# EAGLE design SmodOC1 (EAGLE 6.3)
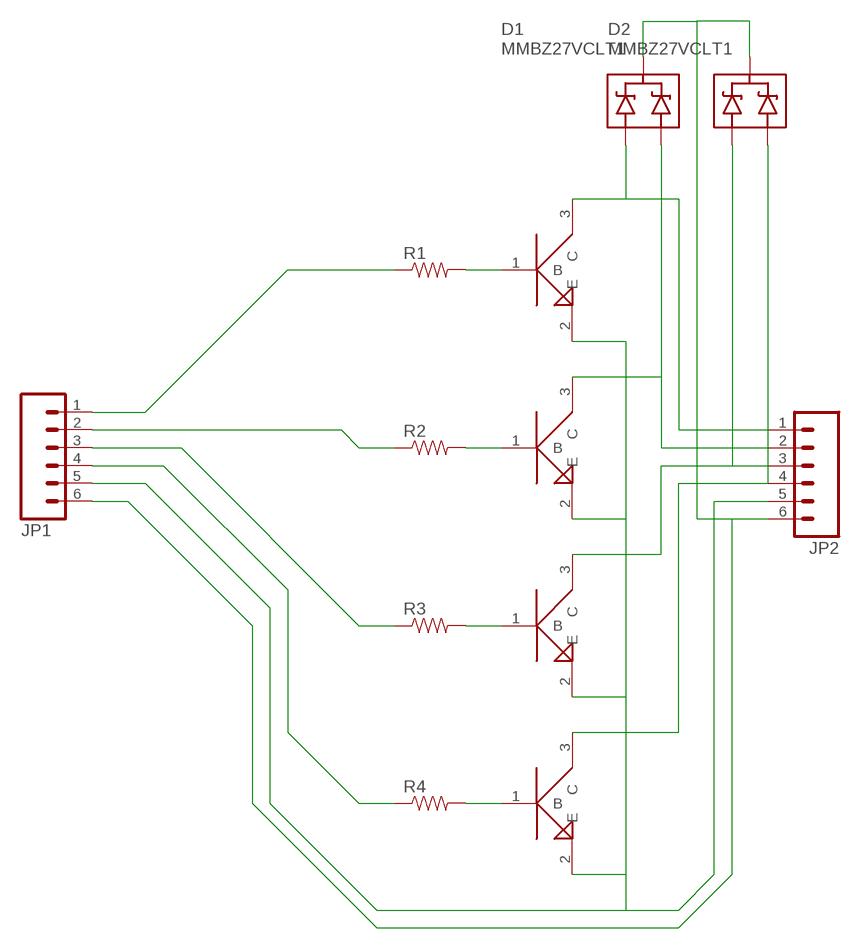
[diagram p0: schematic, sheet 1]

## Parts
D1  MMBZ27VCLT1  [SOT23-3]
D2  MMBZ27VCLT1  [SOT23-3]
JP1  M06POGOPIN_HOLES_ONLY  [1X06_HOLES_ONLY]
JP2  M06POGOPIN_HOLES_ONLY  [1X06_HOLES_ONLY]
Q1  MMBT3904  [SOT-23]
Q2  MMBT3904  [SOT-23]
Q3  MMBT3904  [SOT-23]
Q4  MMBT3904  [SOT-23]
R1  RESISTOR0603-RES  [0603-RES]
R2  RESISTOR0603-RES  [0603-RES]
R3  RESISTOR0603-RES  [0603-RES]
R4  RESISTOR0603-RES  [0603-RES]

## Nets
GND: JP1.5 JP2.5 Q1.2(E) Q2.2(E) Q3.2(E) Q4.2(E)
N$2: Q1.1(B) R1.2
N$4: Q2.1(B) R2.2
N$6: Q3.1(B) R3.2
N$8: Q4.1(B) R4.2
Q1: JP1.1 R1.1
Q2: JP1.2 R2.1
Q3: JP1.3 R3.1
Q4: JP1.4 R4.1
QO1: D1.1(A1) JP2.1 Q1.3(C)
QO2: D1.2(A2) JP2.2 Q2.3(C)
QO3: D2.1(A1) JP2.3 Q3.3(C)
QO4: D2.2(A2) JP2.4 Q4.3(C)
VCC: D1.3(C) D2.3(C) JP1.6 JP2.6

## Library data of the parts
D1 D2 = SparkFun-DiscreteSemi:MMBZ27VCLT1: 40W Zener-diode transient voltage suppressor (ESD protection)
JP1 JP2 = SparkFun-Connectors:M06: Header 6 Standard 6-pin 0.1" header. Use with straight break away headers (SKU : PRT-00116), right angle break away headers (PRT-00553), swiss pins (PRT-00743), machine pins (PRT-00117), and female headers (PRT-00115). Molex polarized connector foot print use with SKU : PRT-08094 with associated crimp pins and housings. NOTES ON THE VARIANTS LOCK and LOCK_LONGPADS... This footprint was designed to help hold the alignment of a through-hole component (i.e. 6-pin header) while soldering it into place. You may notice that each hole has been shifted either up or down by 0.005 of an inch from it's more standard position (which is a perfectly straight line). This slight alteration caused the pins (the squares in the middle) to touch the edges of the holes. Because they are alternating, it causes a "brace" to hold the component in place. 0.005 has proven to be the perfect amount of "off-center" position when using our standard breakaway headers. Although looks a little odd when you look at the bare footprint, once you have a header in there, the alteration is very hard to notice. Also, if you push a header all the way into place, it is covered up entirely on the bottom side. This idea of altering the position of holes to aid alignment will be further integrated into the Sparkfun Library for other footprints. It can help hold any component with 3 or more connection pins.
Q1-Q4 = Strutz Electronic Industries:MMBT3904
R1-R4 = SparkFun-Passives:RESISTOR: Resistor Basic schematic elements and footprints for 0603, 1206, and PTH resistors.

## Board
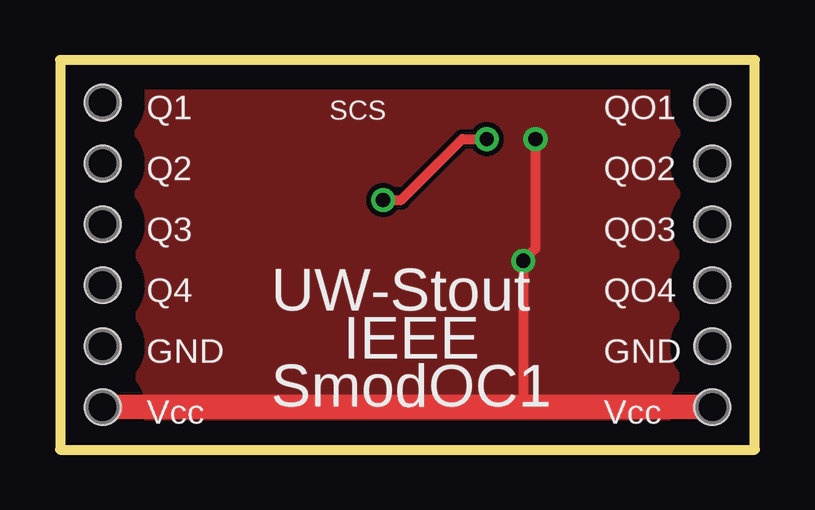
[diagram p1: board, top side]
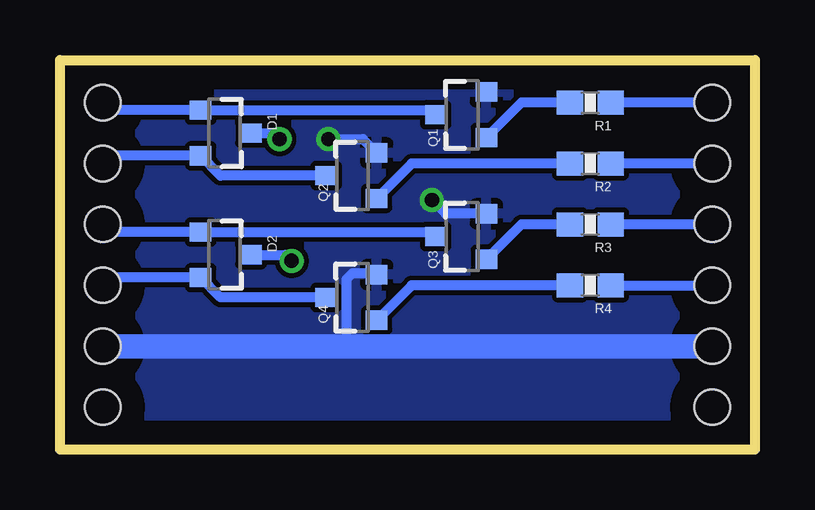
[diagram p2: board, bottom side, seen from below]

Size 28.96 x 16.26 mm. Coordinates in mm from the lower left corner, seen from the top.
Outline: 0,0 28.96,0 28.96,16.26 0,16.26 0,0
Copper layers (1*16): Top 0.035mm / dielectric 1.5mm / Bottom 0.035mm
Design rules "default": minimum track width 10mil, minimum drill 24mil, track to track 8mil, track to pad 8mil, pad to pad 8mil, via to via 8mil, smd to smd 8mil, copper to edge 40mil, drill to drill 8mil, minimum pad ring 10mil, minimum via ring 8mil, stop-mask expansion 4mil, vias tented up to drill 0mil, thermal gap 10mil

### Footprints (pad centres in the part's own frame; a part is rotated, then mirrored left to right if it is on the bottom)
SOT23-3 = smd 0.8 x 0.9: 1 -0.95,-1; 2 0.95,-1; 3 0,1.1
1X06_HOLES_ONLY = drill 0.889 pad 0.813: 1 0,0; 2 2.54,0; 3 5.08,0; 4 7.62,0; 5 10.16,0; 6 12.7,0 | hole 1.473: 0,0; 2.54,0; 5.08,0; 7.62,0; 10.16,0; 12.7,0
SOT-23 = smd 0.8 x 0.9: 1 -0.95,-1; 2 0.95,-1; 3 0,1.1
0603-RES = smd 1.1 x 1: 1 -0.85,0; 2 0.85,0

### Placement (x,y rotation side)
D1  22.1,13.21 270 bottom
D2  22.1,8.13 270 bottom
JP1  1.78,14.48 270 top
JP2  27.18,14.48 270 top
Q1  12.19,13.97 90 bottom
Q2  16.76,11.43 90 bottom
Q3  12.19,8.89 90 bottom
Q4  16.76,6.35 90 bottom
R1  6.86,14.48 180 bottom
R2  6.86,11.94 180 bottom
R3  6.86,9.4 180 bottom
R4  6.86,6.86 180 bottom

### Tracks (layer width: path | path; a pad name or v marks a point on that pad's centre or on a via)
GND  (via drill 0.6)
  Top 0.406: v13.46,10.41 14.22,10.41 16.76,12.95 v17.78,12.95
  Bottom 0.406: Q3.2 12.89,9.84 v13.46,10.41 | v17.78,12.95 16.34,12.95 Q2.2 | 17.02,4.32 17.02,7.11 16.76,7.37 15.83,7.37 Q4.2
  Bottom 1.016: JP2.5 17.02,4.32 JP1.5
  pour Bottom: 0,16.26 28.96,16.26 28.96,0 0,0
N$2
  Bottom 0.406: R1.2 9.73,14.48 Q1.1
N$4
  Bottom 0.406: R2.2 14.31,11.94 Q2.1
N$6
  Bottom 0.406: R3.2 9.73,9.4 Q3.1
N$8
  Bottom 0.406: R4.2 14.31,6.86 Q4.1
Q1
  Bottom 0.406: JP1.1 R1.1
Q2
  Bottom 0.406: JP1.2 R2.1
Q3
  Bottom 0.406: JP1.3 R3.1
Q4
  Bottom 0.406: R4.1 JP1.4
QO1
  Bottom 0.406: Q1.3 13.48,14.16 D1.1 26.86,14.16 JP2.1
QO2
  Bottom 0.406: Q2.3 22.27,11.43 D1.2 26.86,12.26 JP2.2
QO3
  Bottom 0.406: Q3.3 13.48,9.08 D2.1 26.86,9.08 JP2.3
QO4
  Bottom 0.406: Q4.3 22.27,6.35 D2.2 26.86,7.18 JP2.4
VCC  (via drill 0.6)
  Top 0.406: 19.3,1.78 v19.3,7.87 19.81,8.38 v19.81,12.95
  Top 1.016: JP1.6 19.3,1.78 JP2.6
  Bottom 0.406: D2.3 19.56,8.13 v19.3,7.87 | D1.3 20.07,13.21 v19.81,12.95
  pour Top: 0,16.26 28.96,16.26 28.96,0 0,0

### Text on the board
tSilk: Q1 | SCS | QO1 | Q2 | QO2 | Q3 | QO3 | Q4 | UW-Stout | QO4 | GND | IEEE | GND | SmodOC1 | Vcc | Vcc